# EAGLE design Transmission Schematic (EAGLE 8.3.0)
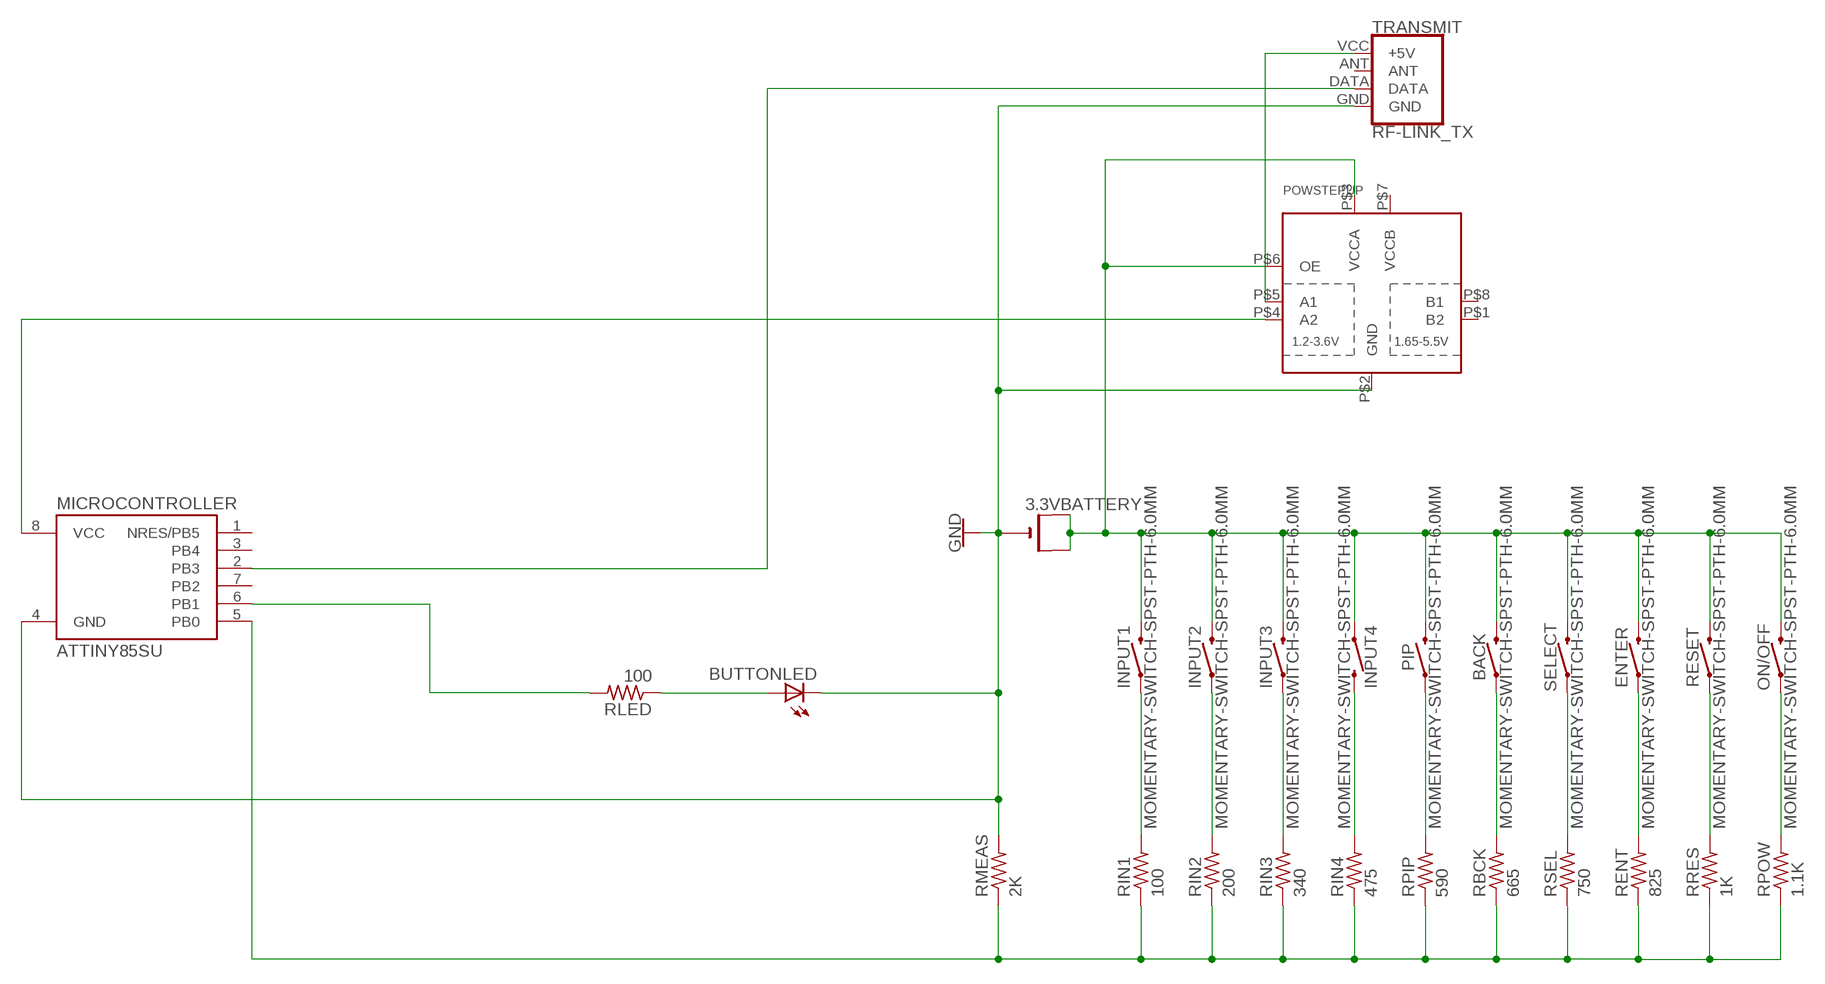
[diagram p0: schematic, sheet 1]

## Parts
3.3VBATTERY  CR1220THM  [CR1220-THM]
BACK  MOMENTARY-SWITCH-SPST-PTH-6.0MM  [TACTILE_SWITCH_PTH_6.0MM]
BUTTONLED  LEDCHIPLED_0805  [CHIPLED_0805]
ENTER  MOMENTARY-SWITCH-SPST-PTH-6.0MM  [TACTILE_SWITCH_PTH_6.0MM]
INPUT1  MOMENTARY-SWITCH-SPST-PTH-6.0MM  [TACTILE_SWITCH_PTH_6.0MM]
INPUT2  MOMENTARY-SWITCH-SPST-PTH-6.0MM  [TACTILE_SWITCH_PTH_6.0MM]
INPUT3  MOMENTARY-SWITCH-SPST-PTH-6.0MM  [TACTILE_SWITCH_PTH_6.0MM]
INPUT4  MOMENTARY-SWITCH-SPST-PTH-6.0MM  [TACTILE_SWITCH_PTH_6.0MM]
MICROCONTROLLER  ATTINY85SU  [ATTINY85]
ON/OFF  MOMENTARY-SWITCH-SPST-PTH-6.0MM  [TACTILE_SWITCH_PTH_6.0MM]
PIP  MOMENTARY-SWITCH-SPST-PTH-6.0MM  [TACTILE_SWITCH_PTH_6.0MM]
POWSTEPUP  TXS0102  [VFSOP-8]
RBCK  665  R-US_R0805  [R0805]
RENT  825  R-US_R0805  [R0805]
RESET  MOMENTARY-SWITCH-SPST-PTH-6.0MM  [TACTILE_SWITCH_PTH_6.0MM]
RIN1  100  R-US_R0805  [R0805]
RIN2  200  R-US_R0805  [R0805]
RIN3  340  R-US_R0805  [R0805]
RIN4  475  R-US_R0805  [R0805]
RLED  100  R-US_R0805  [R0805]
RMEAS  2K  R-US_R0805  [R0805]
RPIP  590  R-US_R0805  [R0805]
RPOW  1.1K  R-US_R0805  [R0805]
RRES  1K  R-US_R0805  [R0805]
RSEL  750  R-US_R0805  [R0805]
SELECT  MOMENTARY-SWITCH-SPST-PTH-6.0MM  [TACTILE_SWITCH_PTH_6.0MM]
TRANSMIT  RF-LINK_TX  [RF-LINK_TX]

## Nets
GND: 3.3VBATTERY.- BUTTONLED.C MICROCONTROLLER.4(GND) POWSTEPUP.P$2(GND) RMEAS.2 TRANSMIT.GND
N$1: 3.3VBATTERY.+1(+) 3.3VBATTERY.+2(+1) BACK.3 ENTER.3 INPUT1.3 INPUT2.3 INPUT3.3 INPUT4.1 ON/OFF.3 PIP.3 POWSTEPUP.P$3(VCCA) POWSTEPUP.P$6(OE) RESET.3 SELECT.3
N$2: INPUT1.1 RIN1.2
N$3: INPUT2.1 RIN2.2
N$4: INPUT3.1 RIN3.2
N$5: INPUT4.3 RIN4.2
N$6: PIP.1 RPIP.2
N$7: BACK.1 RBCK.2
N$8: RSEL.2 SELECT.1
N$9: ENTER.1 RENT.2
N$10: MICROCONTROLLER.5(PB0) RBCK.1 RENT.1 RIN1.1 RIN2.1 RIN3.1 RIN4.1 RMEAS.1 RPIP.1 RPOW.1 RRES.1 RSEL.1
N$11: POWSTEPUP.P$5(A1) TRANSMIT.VCC(+5V)
N$12: MICROCONTROLLER.8(VCC) POWSTEPUP.P$4(A2)
N$13: RESET.1 RRES.2
N$14: ON/OFF.1 RPOW.2
N$15: MICROCONTROLLER.2(PB3) TRANSMIT.DATA
N$16: MICROCONTROLLER.6(PB1) RLED.2
N$17: BUTTONLED.A RLED.1
Unconnected: MICROCONTROLLER.1(NRES/PB5) MICROCONTROLLER.3(PB4) MICROCONTROLLER.7(PB2) POWSTEPUP.P$1(B2) POWSTEPUP.P$7(VCCB) POWSTEPUP.P$8(B1) TRANSMIT.ANT

## Library data of the parts
3.3VBATTERY = adafruit:CR1220: CR1216/CR1220/CR1225 12mm 3V lithium coin cell Great for battery packup. Both SMT and THM holders. Note the THM package has the ground pads on both sides of the PCB so that the masks are the same - this reduces the cost
BACK ENTER INPUT1-INPUT4 ON/OFF PIP RESET SELECT = SparkFun-Switches:MOMENTARY-SWITCH-SPST: Momentary Switch (Pushbutton) - SPST Normally-open (NO) SPST momentary switches (buttons, pushbuttons). Variants PTH-12MM - 12mm square, through-hole Momentary Pushbutton Switch - 12mm Square <https://www.sparkfun.com/products/9190> (COM-09190) PTH-6.0MM, PTH-6.0MM-KIT - 6.0mm square, through-hole Mini Pushbutton Switch <https://www.sparkfun.com/products/97> (COM-00097) KIT package intended for soldering kit's - only one side of pads' copper is exposed. PTH-RIGHT-ANGLE-KIT - Right-angle, through-hole Right Angle Tactile Button <https://www.sparkfun.com/products/10791> - Used on SparkFun BigTime Watch Kit <https://www.sparkfun.com/products/11734> SMD-12MM - 12mm square, surface-mount Tactile Button - SMD (12mm) <https://www.sparkfun.com/products/12993> (COM-12993) Used on SparkFun PicoBoard <https://www.sparkfun.com/products/11888> SMD-4.5MM - 4.5mm Square Trackball Switch Used on SparkFun Blackberry Trackballer Breakout <https://www.sparkfun.com/products/13169> SMD-4.6MMX2.8MM - 4.60mm x 2.80mm, surface mount Used on SparkFun SAMD21 Mini Breakout <https://www.sparkfun.com/products/13664> SMD-5.2MM, SMD-5.2-REDUNDANT - 5.2mm square, surface-mount Mini Pushbutton Switch - SMD <https://www.sparkfun.com/products/8720> (COM-08720) Used on Arduino Pro Mini <https://www.sparkfun.com/products/11114> REDUNDANT package connects both switch circuits together SMD-6.0X3.5MM - 6.0 x 3.5mm, surface mount Momentary Reset Switch SMD <https://www.sparkfun.com/products/8229> (COM-08229) SMD-6.2MM-TALL - 6.2mm square, surface mount Tactile Button - SMD (6mm) <https://www.sparkfun.com/products/12992> Used on SparkFun Digital Sandbox <https://www.sparkfun.com/products/12651> SMD-RIGHT-ANGLE - Right-angle, surface mount Used on SparkFun Block for Intel® Edison - Arduino <https://www.sparkfun.com/products/13036>; PROD_ID: SWCH-08441; SF_SKU: COM-00097
BUTTONLED = adafruit:LED: LED OSRAM: - CHIPLED LG R971, LG N971, LY N971, LG Q971, LY Q971, LO R971, LY R971 LH N974, LH R974 LS Q976, LO Q976, LY Q976 LO Q996 - Hyper CHIPLED LW Q18S LB Q993, LB Q99A, LB R99A - SideLED LS A670, LO A670, LY A670, LG A670, LP A670 LB A673, LV A673, LT A673, LW A673 LH A674 LY A675 LS A676, LA A676, LO A676, LY A676, LW A676 LS A679, LY A679, LG A679 - Hyper Micro SIDELED® LS Y876, LA Y876, LO Y876, LY Y876 LT Y87S - SmartLED LW L88C, LW L88S LB L89C, LB L89S, LG L890 LS L89K, LO L89K, LY L89K LS L896, LA L896, LO L896, LY L896 - TOPLED LS T670, LO T670, LY T670, LG T670, LP T670 LSG T670, LSP T670, LSY T670, LOP T670, LYG T670 LG T671, LOG T671, LSG T671 LB T673, LV T673, LT T673, LW T673 LH T674 LS T676, LA T676, LO T676, LY T676, LB T676, LH T676, LSB T676, LW T676 LB T67C, LV T67C, LT T67C, LS T67K, LO T67K, LY T67K, LW E67C LS E67B, LA E67B, LO E67B, LY E67B, LB E67C, LV E67C, LT E67C LW T67C LS T679, LY T679, LG T679 LS T770, LO T770, LY T770, LG T770, LP T770 LB T773, LV T773, LT T773, LW T773 LH T774 LS E675, LA E675, LY E675, LS T675 LS T776, LA T776, LO T776, LY T776, LB T776 LHGB T686 LT T68C, LB T68C - Hyper Mini TOPLED® LB M676 - Mini TOPLED Santana® LG M470 LS M47K, LO M47K, LY M47K Source: http://www.osram.convergy.de/
MICROCONTROLLER = attiny85:ATTINY85: ATMEL ATtiny 85
POWSTEPUP = adafruit:TXS0102: 2-Bit Bi-Directional Level Shifter (I2C, etc.) Designed for I2C devices and has internal pullups. Not to be confused with TXB010x series. 1.2V-3.6V (VCCA) to 1.65V-5.5V (VCCB) bi-directional level shifter with auto direction sensing. Max data rate - 24Mbps (Push Pull), 2Mbps (Open Drain) Digikey: 296-21931-1-ND
RBCK RENT RIN1-RIN4 RLED RMEAS RPIP RPOW RRES RSEL = adafruit:R-US_: RESISTOR, American symbol
TRANSMIT = SparkFun-RF:RF-LINK_TX: RF Link Transmitter (434 MHz, 315 MHz) These wireless transmitters work with equivalent receivers. They can easily fit into a breadboard and work well with microcontrollers to create a very simple wireless data link. Since these are only transmitters, they will only work communicating data one-way, you would need two pairs (of different frequencies) to act as a transmitter/receiver pair. SparkFun Products RF Link Transmitter - 434MHz <https://www.sparkfun.com/products/10534> (WRL-10534); SF_ID: WRL-10534

## Board
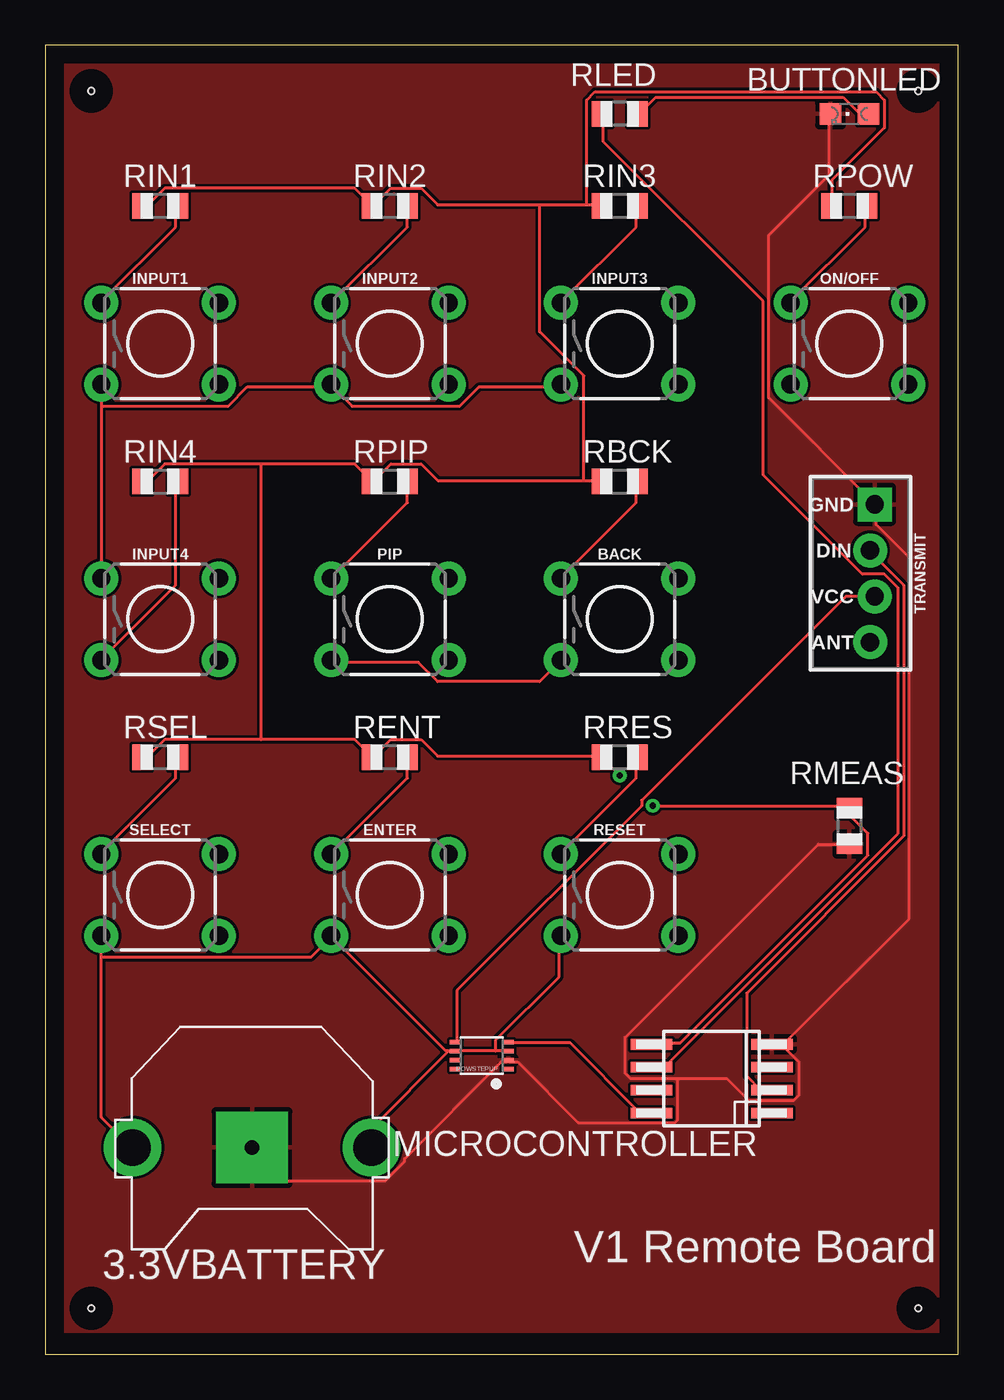
[diagram p1: board, top side]
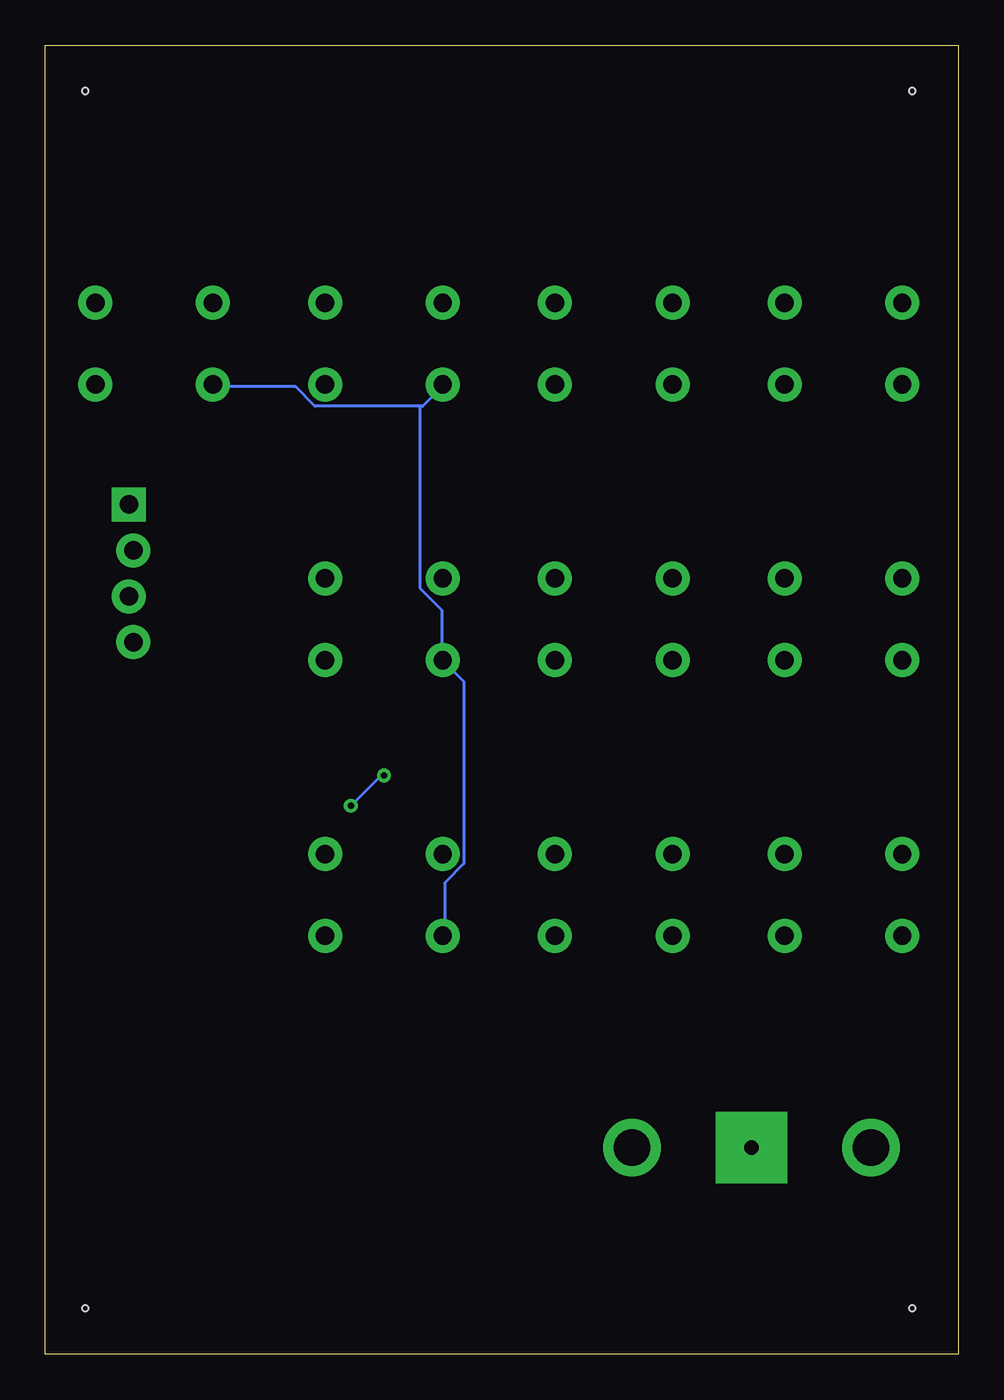
[diagram p2: board, bottom side, seen from below]

Size 50.47 x 72.38 mm. Coordinates in mm from the lower left corner, seen from the top.
Outline: 0,0 50.47,0 50.47,72.38 0,72.38 0,0
Copper layers (1*16): Top 0.035mm / dielectric 1.5mm / Bottom 0.035mm
Design rules "default": minimum track width 6mil, minimum drill 0.35mm, track to track 6mil, track to pad 6mil, pad to pad 6mil, via to via 6mil, smd to smd 6mil, copper to edge 40mil, drill to drill 6mil, minimum pad ring 10mil, minimum via ring 8mil, stop-mask expansion 4mil, vias tented up to drill 0mil, thermal gap 10mil
Holes 0.35 mm at 2.54,69.85 2.54,2.54 48.26,2.54 48.26,69.85

### Footprints (pad centres in the part's own frame; a part is rotated, then mirrored left to right if it is on the bottom)
CR1220-THM = drill 2 pad 3.175: +1 -6.604,0; +2 6.604,0 | drill 0.8 pad 3.962 square: - 0,0
TACTILE_SWITCH_PTH_6.0MM = drill 1.016 pad 1.88: 1 -3.251,2.261; 2 3.251,2.261; 3 -3.251,-2.261; 4 3.251,-2.261
CHIPLED_0805 = smd 1.2 x 1.2: A 0,-1.05; C 0,1.05
ATTINY85 = smd 0.6 x 2.286: 1 -1.905,-3.33; 2 -0.635,-3.33; 3 0.635,-3.33; 4 1.905,-3.33; 5 1.905,3.33; 6 0.635,3.33; 7 -0.635,3.33; 8 -1.905,3.33
VFSOP-8 = smd 0.25 x 0.65: P$1 -0.75,-1.45; P$2 -0.25,-1.45; P$3 0.25,-1.45; P$4 0.75,-1.45; P$5 0.75,1.45; P$6 0.25,1.45; P$7 -0.25,1.45; P$8 -0.75,1.45
R0805 = smd 1.1 x 1.4: 1 -1,0; 2 1,0
RF-LINK_TX = drill 1.016 pad 1.88: ANT 3.81,-0.127; DATA -1.27,-0.127; VCC 1.27,0.127 | drill 1.016 pad 1.88 square: GND -3.81,0.127

### Placement (x,y rotation side)
3.3VBATTERY  11.43,11.43 180 top
BACK  31.75,40.64 0 top
BUTTONLED  44.45,68.58 90 top
ENTER  19.05,25.4 0 top
INPUT1  6.35,55.88 0 top
INPUT2  19.05,55.88 0 top
INPUT3  31.75,55.88 0 top
INPUT4  6.35,40.64 0 top
MICROCONTROLLER  36.83,15.24 90 top
ON/OFF  44.45,55.88 0 top
PIP  19.05,40.64 0 top
POWSTEPUP  24.13,16.51 90 top
RBCK  31.75,48.26 0 top
RENT  19.05,33.02 0 top
RESET  31.75,25.4 0 top
RIN1  6.35,63.5 0 top
RIN2  19.05,63.5 0 top
RIN3  31.75,63.5 0 top
RIN4  6.35,48.26 0 top
RLED  31.75,68.58 180 top
RMEAS  44.45,29.21 270 top
RPIP  19.05,48.26 0 top
RPOW  44.45,63.5 0 top
RRES  31.75,33.02 0 top
RSEL  6.35,33.02 0 top
SELECT  6.35,25.4 0 top
TRANSMIT  45.72,43.18 270 top

### Tracks (layer width: path | path; a pad name or v marks a point on that pad's centre or on a via)
GND
  Top 0.152: BUTTONLED.C 43.33,68.58 43.33,65.23 39.98,61.87 39.98,52.88 45.77,47.09 TRANSMIT.GND 45.92,46.94 45.92,45.87 47.75,44.04 47.75,24.08 40.74,17.07 | 34.95,15.24 37.69,15.24 38.91,14.02 41.35,14.02 41.66,14.33 41.66,16.15 40.74,17.07 | 34.95,15.24 32.36,15.24 32.06,15.54 32.06,17.53 42.72,28.19 44.4,28.19 RMEAS.2 | 40.74,17.07 40.28,17.07 MICROCONTROLLER.4 40.74,17.07 | 3.3VBATTERY.- 11.48,11.43 13.31,9.6 18.8,9.6 19.86,10.67 19.86,10.82 25.2,16.15 25.5,16.15 POWSTEPUP.P$2 25.65,16.15 26.11,16.15 29.46,12.8 34.8,12.8 34.95,12.95 34.95,15.24
  pour Top: -1.27,73.66 -1.27,1.27 52.07,1.27 52.07,73.66
N$1
  Top 0.152: 3.1,21.95 3.1,13.11 4.77,11.43 3.3VBATTERY.+2 | 3.1,21.95 SELECT.3 | 24.89,16.76 25.5,16.76 POWSTEPUP.P$3 | 24.89,16.76 22.76,16.76 POWSTEPUP.P$6 22.61,16.76 22.3,16.76 | 22.3,16.76 18.03,12.5 3.3VBATTERY.+1 | 22.3,16.76 22.15,16.76 15.9,23.01 ENTER.3 15.75,23.01 14.68,21.95 3.1,21.95 | 24.89,16.76 24.89,17.37 28.4,20.88 28.4,23.01 RESET.3 | PIP.3 15.9,38.25 20.63,38.25 21.69,37.19 27.33,37.19 28.4,38.25 BACK.3 | INPUT1.3 3.1,52.43 | 3.1,52.43 INPUT4.1 | 3.1,52.43 10.11,52.43 11.18,53.49 15.75,53.49 INPUT2.3 15.9,53.49 16.97,52.43 22.91,52.43 23.98,53.49 28.4,53.49 INPUT3.3
  Bottom 0.152: 29.77,52.43 29.62,52.43 28.55,53.49 INPUT3.3 | 29.77,52.43 35.56,52.43 36.63,53.49 41.2,53.49 ON/OFF.3 | 29.77,52.43 29.77,42.37 28.55,41.15 28.55,38.41 BACK.3 28.4,38.25 27.33,37.19 27.33,27.13 28.4,26.06 28.4,23.16 RESET.3
N$2
  Top 0.152: RIN1.2 7.21,63.4 7.21,62.33 3.1,58.22 INPUT1.1
N$3
  Top 0.152: RIN2.2 20.01,63.4 20.01,62.33 15.9,58.22 INPUT2.1
N$4
  Top 0.152: RIN3.2 32.66,63.4 32.66,62.33 28.55,58.22 INPUT3.1
N$5
  Top 0.152: RIN4.2 7.21,48.16 7.21,42.52 3.1,38.41 INPUT4.3
N$6
  Top 0.152: RPIP.2 20.01,48.16 20.01,47.09 15.9,42.98 PIP.1
N$7
  Top 0.152: RBCK.2 32.66,48.16 32.66,47.09 28.55,42.98 BACK.1
N$8
  Top 0.152: RSEL.2 7.21,32.92 7.21,31.85 3.1,27.74 SELECT.1
N$9
  Top 0.152: RENT.2 20.01,32.92 20.01,31.85 15.9,27.74 ENTER.1
N$10  (via drill 0.35)
  Top 0.152: RIN1.1 5.39,63.55 5.69,63.55 6.6,64.47 17.12,64.47 18.03,63.55 RIN2.1 18.19,63.55 19.1,64.47 20.78,64.47 21.69,63.55 27.33,63.55 | 27.33,63.55 29.92,63.55 | 29.92,63.55 30.68,63.55 RIN3.1 | 29.92,63.55 29.92,69.34 30.38,69.8 45.92,69.8 46.38,69.34 46.38,67.82 43.48,64.92 43.48,63.55 RPOW.1 | 11.94,49.23 17.12,49.23 18.03,48.31 RPIP.1 18.19,48.31 19.1,49.23 20.78,49.23 21.69,48.31 29.77,48.31 | 11.94,49.23 6.6,49.23 5.69,48.31 5.39,48.31 RIN4.1 | 29.77,48.31 30.68,48.31 RBCK.1 | MICROCONTROLLER.5 33.58,17.22 35.1,17.22 45.47,27.58 45.47,28.8 44.55,29.72 44.55,30.18 RMEAS.1 44.4,30.33 v33.58,30.33 | 11.94,33.98 17.12,33.98 18.03,33.07 RENT.1 18.19,33.07 19.1,33.98 20.78,33.98 21.69,33.07 30.68,33.07 RRES.1 30.84,32.92 v31.75,32 | 11.94,33.98 6.6,33.98 5.69,33.07 5.39,33.07 RSEL.1 | 11.94,33.98 11.94,49.23 | 27.33,63.55 27.33,56.54 29.77,54.1 29.77,48.31
  Bottom 0.152: v33.58,30.33 31.9,32 v31.75,32
N$11
  Top 0.152: TRANSMIT.VCC 44.25,41.91 32.97,30.63 32.97,30.33 22.76,20.12 22.76,17.37 POWSTEPUP.P$5
N$12
  Top 0.152: POWSTEPUP.P$4 25.65,17.22 29.01,17.22 32.82,13.41 33.43,13.41 MICROCONTROLLER.8
N$13
  Top 0.152: RRES.2 32.66,32.92 32.66,31.85 28.55,27.74 RESET.1
N$14
  Top 0.152: RPOW.2 45.31,63.4 45.31,62.33 41.2,58.22 ON/OFF.1
N$15
  Top 0.152: MICROCONTROLLER.2 40.13,14.63 39.52,14.63 38.76,15.39 38.76,19.96 47.45,28.65 47.45,42.52 45.62,44.35 TRANSMIT.DATA
N$16
  Top 0.152: RLED.2 30.84,68.58 30.84,67.06 39.67,58.22 39.67,48.62 45.16,43.13 46.38,43.13 47.14,42.37 47.14,28.8 34.34,16 33.58,16 MICROCONTROLLER.6
N$17
  Top 0.152: BUTTONLED.A 45.01,68.58 44.09,69.49 33.73,69.49 32.82,68.58 RLED.1

### Text on the board
tNames: V1 | Remote Board